# EAGLE design dc (EAGLE 6.3)
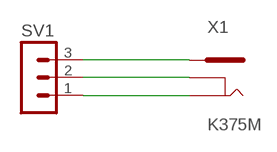
[diagram p0: schematic, sheet 1]

## Parts
SV1  MA03-1  [MA03-1]
X1  K375M  [K375M]

## Nets
N$1: SV1.3 X1.P$7
N$2: SV1.2 X1.P$6
N$3: SV1.1 X1.P$1

## Library data of the parts
SV1 = con-lstb:MA03-1: PIN HEADER; OC_FARNELL: unknown; OC_NEWARK: unknown
X1 = con-power c:K375M: K375M - DC POWER JACK 2.5mm/CENTRAL PIN Source: Data sheet <http://www.shallin.com/productview.aspx?itemnumber=K375M>

## Board
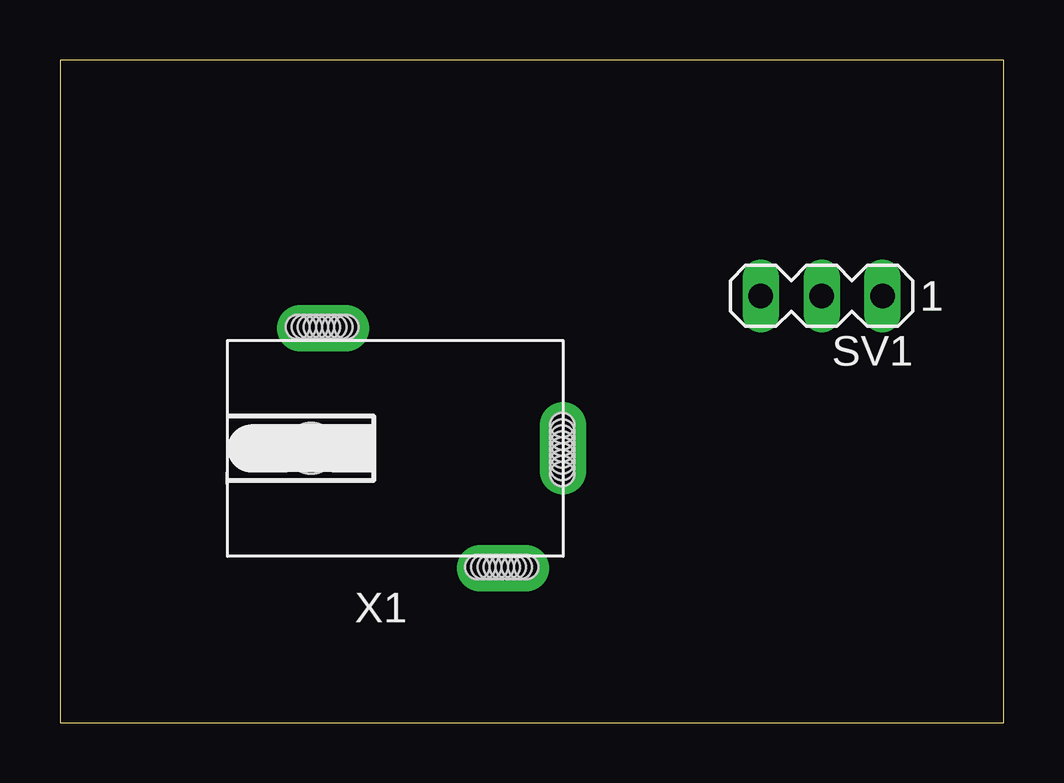
[diagram p1: board, top side]
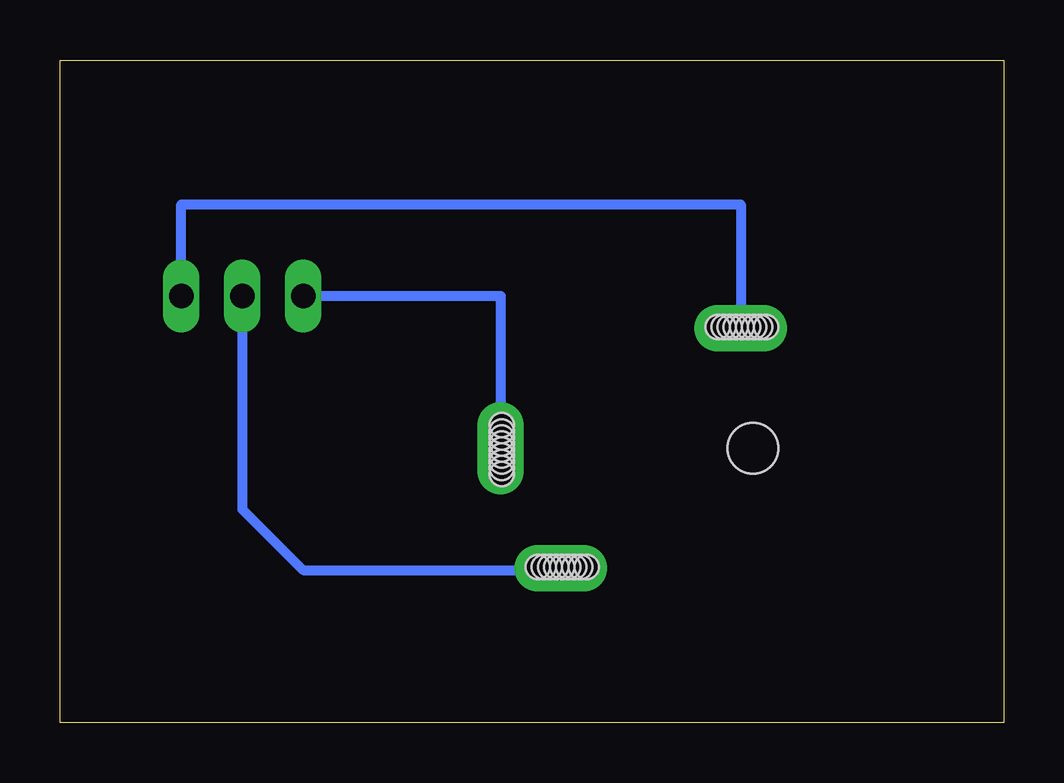
[diagram p2: board, bottom side, seen from below]

Size 39.35 x 27.61 mm. Coordinates in mm from the lower left corner, seen from the top.
Outline: 0,0 39.35,0 39.35,27.61 0,27.61 0,0
Copper layers (1*16): Top 0.035mm / dielectric 1.5mm / Bottom 0.035mm
Design rules "default": minimum track width 10mil, minimum drill 24mil, track to track 8mil, track to pad 8mil, pad to pad 8mil, via to via 8mil, smd to smd 8mil, copper to edge 40mil, drill to drill 8mil, minimum pad ring 10mil, minimum via ring 8mil, stop-mask expansion 4mil, vias tented up to drill 0mil, thermal gap 10mil

### Footprints (pad centres in the part's own frame; a part is rotated, then mirrored left to right if it is on the bottom)
MA03-1 = drill 1.016 long: 1 -2.54,0; 2 0,0; 3 2.54,0
K375M = drill 1 pad 1.93 long: P$1 5,3; P$6 -5,-4.5; P$7 0.004,-7.007 | hole 2.1: 0,3.5 | hole 1: -4.953,-3.429; -4.953,-3.683; -4.953,-3.937; -4.953,-4.191; -4.953,-4.445; -4.953,-4.699; -4.953,-4.953; -4.953,-5.207; -4.953,-5.461; -1.067,-6.96; -0.813,-6.96; -0.559,-6.96; -0.305,-6.96; -0.051,-6.96; 0.203,-6.96; 0.457,-6.96; 0.711,-6.96; 0.965,-6.96; 5.055,4.064; 5.055,3.81; 5.055,3.556; 5.055,3.302; 5.055,3.048; 5.055,2.794; 5.055,2.54; 5.055,2.286; 5.055,2.032

### Placement (x,y rotation side)
SV1  31.75,17.78 180 top
X1  13.97,11.43 90 top

### Tracks (layer width: path | path; a pad name or v marks a point on that pad's centre or on a via)
N$1
  Bottom 0.406: SV1.3 20.98,17.78 X1.P$7
N$2
  Bottom 0.406: SV1.2 31.75,8.89 29.21,6.35 18.55,6.35 X1.P$6
N$3
  Bottom 0.406: SV1.1 34.29,21.59 10.97,21.59 X1.P$1